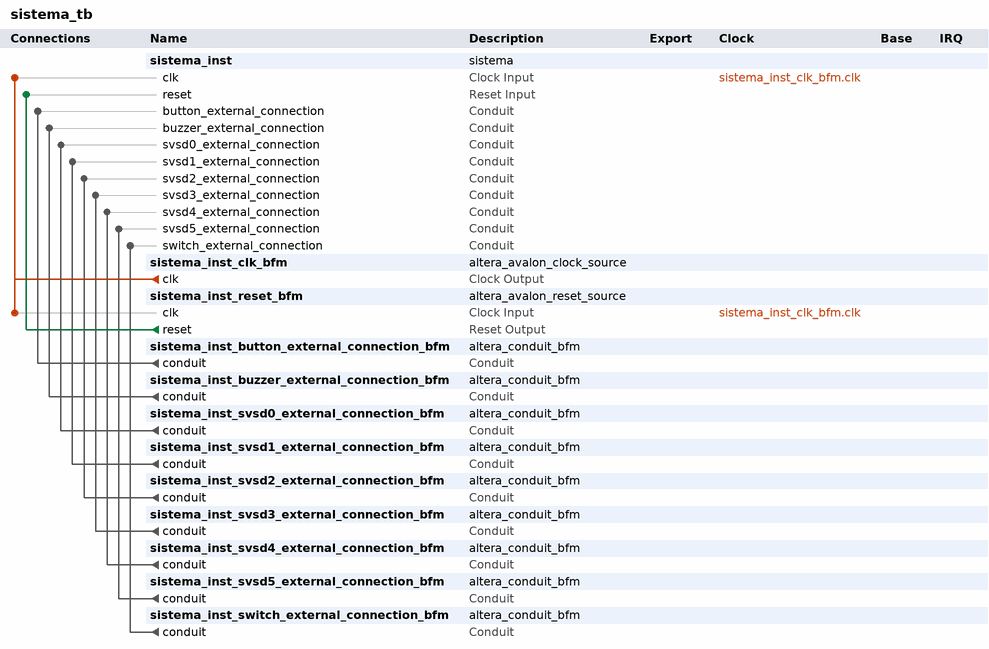
[diagram p0: system contents]
# Platform Designer (Qsys) system sistema_tb, Cyclone IV E EP4CE10E22A7
# Parameters at their usual value, and those the tool derives, are not listed.
package require -exact qsys 18.1
create_system sistema_tb
set_project_property DEVICE_FAMILY {Cyclone IV E}
set_project_property DEVICE EP4CE10E22A7

add_instance sistema_inst sistema 1.0

add_instance sistema_inst_clk_bfm altera_avalon_clock_source 18.1

add_instance sistema_inst_reset_bfm altera_avalon_reset_source 18.1
set_instance_parameter_value sistema_inst_reset_bfm ASSERT_HIGH_RESET 0
set_instance_parameter_value sistema_inst_reset_bfm INITIAL_RESET_CYCLES 50

add_instance sistema_inst_button_external_connection_bfm altera_conduit_bfm 18.1
set_instance_parameter_value sistema_inst_button_external_connection_bfm CLOCKED_SIGNAL false
set_instance_parameter_value sistema_inst_button_external_connection_bfm ENABLE_RESET false
set_instance_parameter_value sistema_inst_button_external_connection_bfm SIGNAL_DIRECTIONS output
set_instance_parameter_value sistema_inst_button_external_connection_bfm SIGNAL_WIDTHS 4

add_instance sistema_inst_buzzer_external_connection_bfm altera_conduit_bfm 18.1
set_instance_parameter_value sistema_inst_buzzer_external_connection_bfm CLOCKED_SIGNAL false
set_instance_parameter_value sistema_inst_buzzer_external_connection_bfm ENABLE_RESET false
set_instance_parameter_value sistema_inst_buzzer_external_connection_bfm SIGNAL_DIRECTIONS input
set_instance_parameter_value sistema_inst_buzzer_external_connection_bfm SIGNAL_WIDTHS 10

add_instance sistema_inst_svsd0_external_connection_bfm altera_conduit_bfm 18.1
set_instance_parameter_value sistema_inst_svsd0_external_connection_bfm CLOCKED_SIGNAL false
set_instance_parameter_value sistema_inst_svsd0_external_connection_bfm ENABLE_RESET false
set_instance_parameter_value sistema_inst_svsd0_external_connection_bfm SIGNAL_DIRECTIONS input
set_instance_parameter_value sistema_inst_svsd0_external_connection_bfm SIGNAL_WIDTHS 4

add_instance sistema_inst_svsd1_external_connection_bfm altera_conduit_bfm 18.1
set_instance_parameter_value sistema_inst_svsd1_external_connection_bfm CLOCKED_SIGNAL false
set_instance_parameter_value sistema_inst_svsd1_external_connection_bfm ENABLE_RESET false
set_instance_parameter_value sistema_inst_svsd1_external_connection_bfm SIGNAL_DIRECTIONS input
set_instance_parameter_value sistema_inst_svsd1_external_connection_bfm SIGNAL_WIDTHS 4

add_instance sistema_inst_svsd2_external_connection_bfm altera_conduit_bfm 18.1
set_instance_parameter_value sistema_inst_svsd2_external_connection_bfm CLOCKED_SIGNAL false
set_instance_parameter_value sistema_inst_svsd2_external_connection_bfm ENABLE_RESET false
set_instance_parameter_value sistema_inst_svsd2_external_connection_bfm SIGNAL_DIRECTIONS input
set_instance_parameter_value sistema_inst_svsd2_external_connection_bfm SIGNAL_WIDTHS 4

add_instance sistema_inst_svsd3_external_connection_bfm altera_conduit_bfm 18.1
set_instance_parameter_value sistema_inst_svsd3_external_connection_bfm CLOCKED_SIGNAL false
set_instance_parameter_value sistema_inst_svsd3_external_connection_bfm ENABLE_RESET false
set_instance_parameter_value sistema_inst_svsd3_external_connection_bfm SIGNAL_DIRECTIONS input
set_instance_parameter_value sistema_inst_svsd3_external_connection_bfm SIGNAL_WIDTHS 4

add_instance sistema_inst_svsd4_external_connection_bfm altera_conduit_bfm 18.1
set_instance_parameter_value sistema_inst_svsd4_external_connection_bfm CLOCKED_SIGNAL false
set_instance_parameter_value sistema_inst_svsd4_external_connection_bfm ENABLE_RESET false
set_instance_parameter_value sistema_inst_svsd4_external_connection_bfm SIGNAL_DIRECTIONS input
set_instance_parameter_value sistema_inst_svsd4_external_connection_bfm SIGNAL_WIDTHS 4

add_instance sistema_inst_svsd5_external_connection_bfm altera_conduit_bfm 18.1
set_instance_parameter_value sistema_inst_svsd5_external_connection_bfm CLOCKED_SIGNAL false
set_instance_parameter_value sistema_inst_svsd5_external_connection_bfm ENABLE_RESET false
set_instance_parameter_value sistema_inst_svsd5_external_connection_bfm SIGNAL_DIRECTIONS input
set_instance_parameter_value sistema_inst_svsd5_external_connection_bfm SIGNAL_WIDTHS 4

add_instance sistema_inst_switch_external_connection_bfm altera_conduit_bfm 18.1
set_instance_parameter_value sistema_inst_switch_external_connection_bfm CLOCKED_SIGNAL false
set_instance_parameter_value sistema_inst_switch_external_connection_bfm ENABLE_RESET false
set_instance_parameter_value sistema_inst_switch_external_connection_bfm SIGNAL_DIRECTIONS input
set_instance_parameter_value sistema_inst_switch_external_connection_bfm SIGNAL_WIDTHS 8

# connections
add_connection sistema_inst_clk_bfm.clk sistema_inst.clk clock
add_connection sistema_inst_clk_bfm.clk sistema_inst_reset_bfm.clk clock
add_connection sistema_inst_reset_bfm.reset sistema_inst.reset reset
add_connection sistema_inst_button_external_connection_bfm.conduit sistema_inst.button_external_connection conduit
add_connection sistema_inst_buzzer_external_connection_bfm.conduit sistema_inst.buzzer_external_connection conduit
add_connection sistema_inst_svsd0_external_connection_bfm.conduit sistema_inst.svsd0_external_connection conduit
add_connection sistema_inst_svsd1_external_connection_bfm.conduit sistema_inst.svsd1_external_connection conduit
add_connection sistema_inst_svsd2_external_connection_bfm.conduit sistema_inst.svsd2_external_connection conduit
add_connection sistema_inst_svsd3_external_connection_bfm.conduit sistema_inst.svsd3_external_connection conduit
add_connection sistema_inst_svsd4_external_connection_bfm.conduit sistema_inst.svsd4_external_connection conduit
add_connection sistema_inst_svsd5_external_connection_bfm.conduit sistema_inst.svsd5_external_connection conduit
add_connection sistema_inst_switch_external_connection_bfm.conduit sistema_inst.switch_external_connection conduit

set_interconnect_requirement {$system} qsys_mm.clockCrossingAdapter HANDSHAKE
set_interconnect_requirement {$system} qsys_mm.enableEccProtection FALSE
set_interconnect_requirement {$system} qsys_mm.insertDefaultSlave FALSE
set_interconnect_requirement {$system} qsys_mm.maxAdditionalLatency 1

save_system sistema_tb.qsys
